# Altium schematic sheet 2轴4.0-.SchDoc
size A3
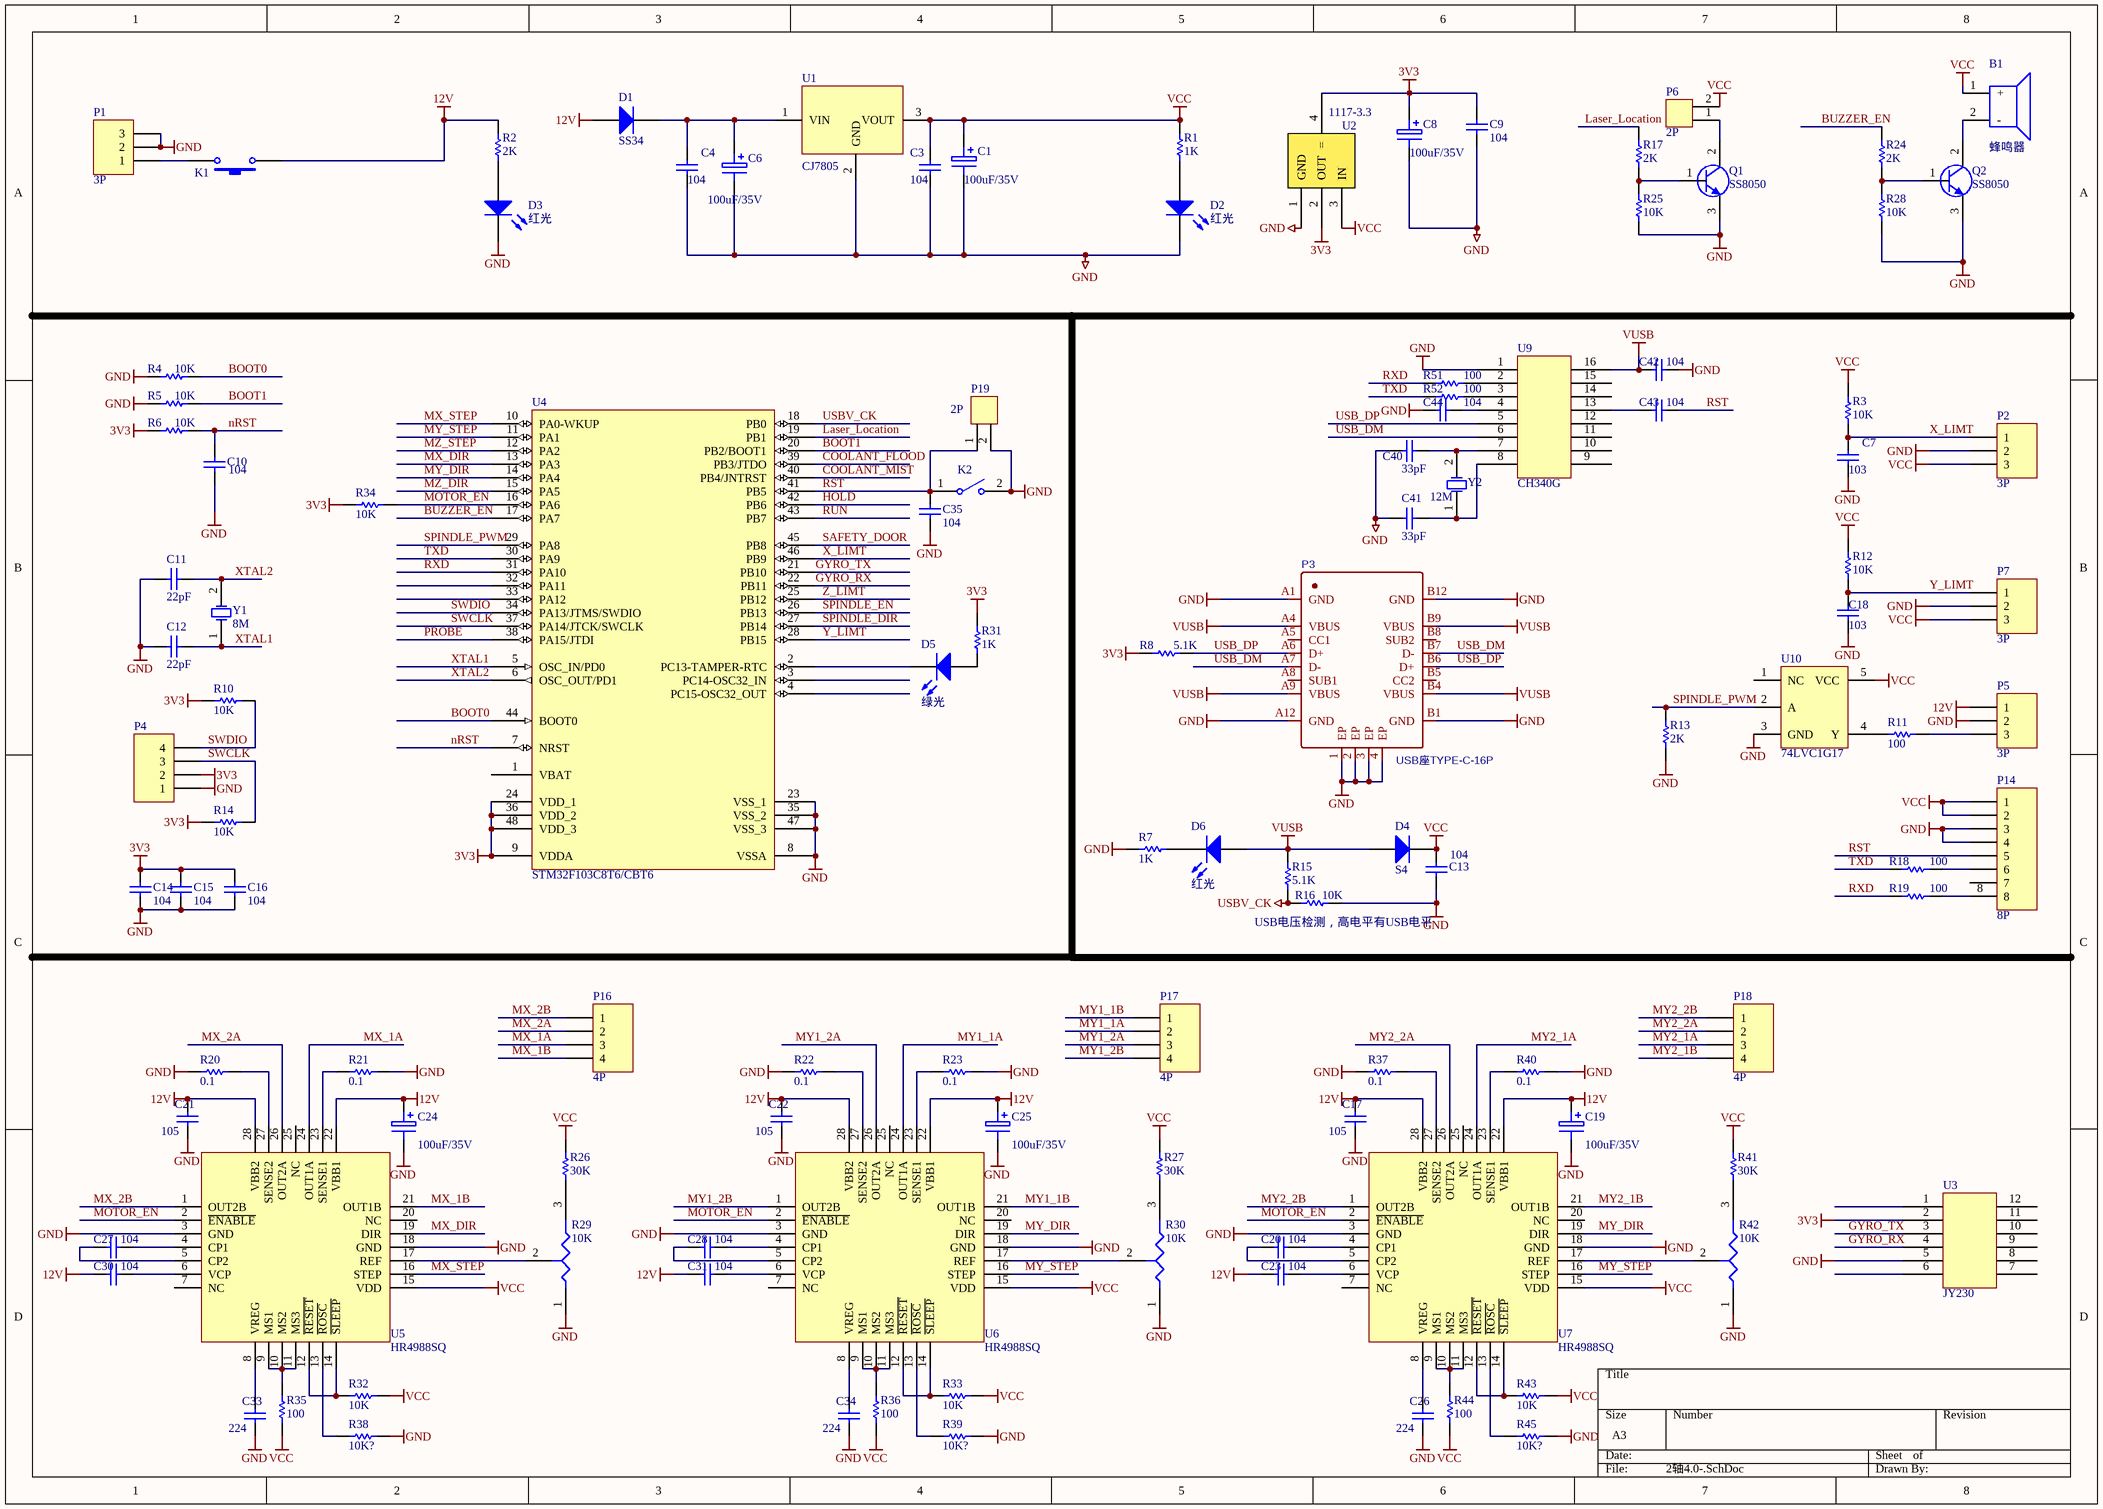
[diagram p0: 2轴4.0-.SchDoc]

## Parts
B1  蜂鸣器  [蜂鸣器9]
C1  100uF/35V  [电解电容贴片6x6]
C3  104  [0603C]
C4  104  [0603C]
C6  100uF/35V  [电解电容贴片6x6]
C7  103  [0603C]
C8  100uF/35V  [电解电容贴片6x6]
C9  104  [0603C]
C10  104  [0603C]
C11  22pF  [0603C]
C12  22pF  [0603C]
C13  104  [0603C]
C14  104  [0603C]
C15  104  [0603C]
C16  104  [0603C]
C17  105  [0805C]
C18  103  [0603C]
C19  100uF/35V  [电解电容贴片6x6]
C20  104  [0603C]
C21  105  [0805C]
C22  105  [0805C]
C23  104  [0603C]
C24  100uF/35V  [电解电容贴片6x6]
C25  100uF/35V  [电解电容贴片6x6]
C26  224  [0603C]
C27  104  [0603C]
C28  104  [0603C]
C30  104  [0603C]
C31  104  [0603C]
C33  224  [0603C]
C34  224  [0603C]
C35  104  [0603C]
C40  33pF  [0603C]
C41  33pF  [0603C]
C42  104  [0603C]
C43  104  [0603C]
C44  104  [0603C]
D1  SS34  [SMA]
D2  红光  [0603LED]
D3  红光  [0603LED]
D4  S4  [SOD-123]
D5  绿光  [0603LED]
D6  红光  [0603LED]
K1  按键  [按键18x13]  (value not drawn)
K2  开关  [按键6x6贴片]  (value not drawn)
P1  3P  [DC0044A]
P2  3P  [HDR1X3_P]
P3  USB座TYPE-C-16P  [USB-TYPE-C-16P]
P4  (no value)  [SIP4]
P5  3P  [HDR1X3_P]
P6  2P  [HDR1X2_P]
P7  3P  [HDR1X3_P]
P14  8P  [IDC8弯脚]
P16  4P  [HDR1X4_P]
P17  4P  [HDR1X4_P]
P18  4P  [HDR1X4_P]
P19  2P  [HDR1X2_P]
Q1  SS8050  [SOT-23]
Q2  SS8050  [SOT-23]
R1  1K  [0603R]
R2  2K  [0603R]
R3  10K  [0603R]
R4  10k  [0603R]
R5  10k  [0603R]
R6  10k  [0603R]
R7  1K  [0603R]
R8  5.1K  [0603R]
R10  10k  [0603R]
R11  100  [0603R]
R12  10K  [0603R]
R13  2K  [0603R]
R14  10k  [0603R]
R15  5.1K  [0603R]
R16  10K  [0603R]
R17  2K  [0603R]
R18  100  [0603R]
R19  100  [0603R]
R20  0.1  [0805R]
R21  0.1  [0805R]
R22  0.1  [0805R]
R23  0.1  [0805R]
R24  2K  [0603R]
R25  10K  [0603R]
R26  30K  [0603R]
R27  30K  [0603R]
R28  10K  [0603R]
R29  10K  [松下贴片电位器3x3]
R30  10K  [松下贴片电位器3x3]
R31  1K  [0603R]
R32  10K  [0603R]
R33  10K  [0603R]
R34  10K  [0603R]
R35  100  [0603R]
R36  100  [0603R]
R37  0.1  [0805R]
R38  10K?  [0603R]
R39  10K?  [0603R]
R40  0.1  [0805R]
R41  30K  [0603R]
R42  10K  [松下贴片电位器3x3]
R43  10K  [0603R]
R44  100  [0603R]
R45  10K?  [0603R]
R51  100  [0603R]
R52  100  [0603R]
U1  CJ7805  [TO-263-2]
U2  1117-3.3  [SOT-223]
U3  JY230  [舵螺仪JY-230]
U4  STM32F103C8T6/CBT6  [LQFP48]
U5  HR4988SQ  [QFN28]
U6  HR4988SQ  [QFN28]
U7  HR4988SQ  [QFN28]
U9  CH340G  [SOP16]
U10  74LVC1G17  [SOT-23-5]
Y1  8M  [晶振贴片]
Y2  12M  [晶振贴片49SSMD]

## Nets
3V3: C8.1 C9.2 C14.2 C15.2 C16.2 P4.2 R6.1 R8.1 R10.2 R14.2 R31.2 R34.2 U2.2(OUT) U2.4(=) U3.2 U4.9(VDDA) U4.24(VDD_1) U4.36(VDD_2) U4.48(VDD_3)
12V: C17.1 C19.1 C21.1 C22.1 C23.2 C24.1 C25.1 C30.2 C31.2 D1.1 K1.1 P5.1 R2.1 U5.22(VBB1) U5.28(VBB2) U6.22(VBB1) U6.28(VBB2) U7.22(VBB1) U7.28(VBB2)
GND: C1.2 C3.1 C4.1 C6.2 C7.1 C8.2 C9.1 C10.1 C11.2 C12.2 C13.1 C14.1 C15.1 C16.1 C17.2 C18.1 C19.2 C21.2 C22.2 C24.2 C25.2 C26.2 C33.2 C34.2 C35.2 C40.2 C41.2 C42.2 C44.2 D2.2 D3.2 K2.2(NO) P1.2 P1.3 P2.2 P3.1(EP) P3.2(EP) P3.3(EP) P3.4(EP) P3.A1(GND) P3.A12(GND) P3.B1(GND) P3.B12(GND) P4.1 P5.2 P7.2 P14.3 P14.4 P19.2 Q1.3(E) Q2.3(E) R4.1 R5.1 R7.1 R13.1 R16.1 R20.2 R21.1 R22.2 R23.1 R25.1 R28.1 R29.1(A) R30.1(A) R37.2 R38.2 R39.2 R40.1 R42.1(A) R45.2 U1.2(GND) U2.1(GND) U3.5 U4.8(VSSA) U4.23(VSS_1) U4.35(VSS_2) U4.47(VSS_3) U5.3(GND) U5.18(GND) U6.3(GND) U6.18(GND) U7.3(GND) U7.18(GND) U9.1 U10.3(GND)
USBV_CK: R15.1 R16.2 U4.18(PB0)
VCC: B1.1(+) C1.1 C3.2 C13.2 D4.2 P2.3 P6.2 P7.3 P14.1 P14.2 R1.1 R3.2 R12.2 R26.2 R27.2 R32.1 R33.1 R35.1 R36.1 R41.2 R43.1 R44.1 U1.3(VOUT) U2.3(IN) U5.15(VDD) U6.15(VDD) U7.15(VDD) U10.5(VCC)
VUSB: C42.1 D4.1 D6.1 P3.A4(VBUS) P3.A9(VBUS) P3.B4(VBUS) P3.B9(VBUS) R15.2 U9.16
BOOT0: R4.2 U4.44(BOOT0)
BOOT1: R5.2 U4.20(PB2/BOOT1)
BUZZER_EN: R24.1 U4.17(PA7)
COOLANT_FLOOD: U4.39(PB3/JTDO)
COOLANT_MIST: U4.40(PB4/JNTRST)
GYRO_RX: U3.4 U4.22(PB11)
GYRO_TX: U3.3 U4.21(PB10)
HOLD: U4.42(PB6)
Laser_Location: R17.1 U4.19(PB1)
MOTOR_EN: R34.1 U4.16(PA6) U5.2(~{ENABLE}) U6.2(~{ENABLE}) U7.2(~{ENABLE})
MX_1A: P16.3 U5.24(OUT1A)
MX_1B: P16.4 U5.21(OUT1B)
MX_2A: P16.2 U5.26(OUT2A)
MX_2B: P16.1 U5.1(OUT2B)
MX_DIR: U4.13(PA3) U5.19(DIR)
MX_STEP: U4.10(PA0-WKUP) U5.16(STEP)
MY1_1A: P17.2 U6.24(OUT1A)
MY1_1B: P17.1 U6.21(OUT1B)
MY1_2A: P17.3 U6.26(OUT2A)
MY1_2B: P17.4 U6.1(OUT2B)
MY2_1A: P18.3 U7.24(OUT1A)
MY2_1B: P18.4 U7.21(OUT1B)
MY2_2A: P18.2 U7.26(OUT2A)
MY2_2B: P18.1 U7.1(OUT2B)
MY_DIR: U4.14(PA4) U6.19(DIR) U7.19(DIR)
MY_STEP: U4.11(PA1) U6.16(STEP) U7.16(STEP)
MZ_DIR: U4.15(PA5)
MZ_STEP: U4.12(PA2)
nRST: C10.2 R6.2 U4.7(NRST)
PROBE: U4.38(PA15/JTDI)
RST: C35.1 C43.2 K2.1(COMMON) P14.5 P19.1 U4.41(PB5)
RUN: U4.43(PB7)
RXD: R19.1 R51.2 U4.31(PA10)
SAFETY_DOOR: U4.45(PB8)
SPINDLE_DIR: U4.27(PB14)
SPINDLE_EN: U4.26(PB13)
SPINDLE_PWM: R13.2 U4.29(PA8) U10.2(A)
SWCLK: P4.3 R14.1 U4.37(PA14/JTCK/SWCLK)
SWDIO: P4.4 R10.1 U4.34(PA13/JTMS/SWDIO)
TXD: R18.1 R52.2 U4.30(PA9)
USB_DM: P3.A7(D-) P3.B7(D-) U9.6
USB_DP: P3.A6(D+) P3.B6(D+) R8.2 U9.5
X_LIMT: C7.2 P2.1 R3.1 U4.46(PB9)
XTAL1: C12.1 U4.5(OSC_IN/PD0) Y1.1(OSC1)
XTAL2: C11.1 U4.6(OSC_OUT/PD1) Y1.2(OSC2)
Y_LIMT: C18.2 P7.1 R12.1 U4.28(PB15)
Z_LIMT: U4.25(PB12)
NetB1_2: B1.2(-) Q2.2(C)
NetC4_2: C4.2 C6.1 D1.2 U1.1(VIN)
NetC20_1: C20.1 U7.4(CP1)
NetC20_2: C20.2 U7.5(CP2)
NetC23_1: C23.1 U7.6(VCP)
NetC26_1: C26.1 U7.8(VREG)
NetC27_1: C27.1 U5.4(CP1)
NetC27_2: C27.2 U5.5(CP2)
NetC28_1: C28.1 U6.4(CP1)
NetC28_2: C28.2 U6.5(CP2)
NetC30_1: C30.1 U5.6(VCP)
NetC31_1: C31.1 U6.6(VCP)
NetC33_1: C33.1 U5.8(VREG)
NetC34_1: C34.1 U6.8(VREG)
NetC40_1: C40.1 U9.7 Y2.2(OSC2)
NetC41_1: C41.1 U9.8 Y2.1(OSC1)
NetC43_1: C43.1 U9.13
NetC44_1: C44.1 U9.4
NetD2_1: D2.1 R1.2
NetD3_1: D3.1 R2.2
NetD5_1: D5.1 R31.1
NetD5_2: D5.2 U4.2(PC13-TAMPER-RTC)
NetD6_2: D6.2 R7.2
NetK1_2: K1.2 P1.1
NetP5_3: P5.3 R11.2
NetP6_1: P6.1 Q1.2(C)
NetP14_6: P14.6 R18.2
NetP14_8: P14.8 R19.2
NetQ1_1: Q1.1(B) R17.2 R25.2
NetQ2_1: Q2.1(B) R24.2 R28.2
NetR11_1: R11.1 U10.4(Y)
NetR20_1: R20.1 U5.27(SENSE2)
NetR21_2: R21.2 U5.23(SENSE1)
NetR22_1: R22.1 U6.27(SENSE2)
NetR23_2: R23.2 U6.23(SENSE1)
NetR26_1: R26.1 R29.3(B)
NetR27_1: R27.1 R30.3(B)
NetR29_2: R29.2(TAP) U5.17(REF)
NetR30_2: R30.2(TAP) U6.17(REF)
NetR32_2: R32.2 U5.12(~{RESET}) U5.14(~{SLEEP})
NetR33_2: R33.2 U6.12(~{RESET}) U6.14(~{SLEEP})
NetR35_2: R35.2 U5.9(MS1) U5.10(MS2) U5.11(MS3)
NetR36_2: R36.2 U6.9(MS1) U6.10(MS2) U6.11(MS3)
NetR37_1: R37.1 U7.27(SENSE2)
NetR38_1: R38.1 U5.13(~{ROSC})
NetR39_1: R39.1 U6.13(~{ROSC})
NetR40_2: R40.2 U7.23(SENSE1)
NetR41_1: R41.1 R42.3(B)
NetR42_2: R42.2(TAP) U7.17(REF)
NetR43_2: R43.2 U7.12(~{RESET}) U7.14(~{SLEEP})
NetR44_2: R44.2 U7.9(MS1) U7.10(MS2) U7.11(MS3)
NetR45_1: R45.1 U7.13(~{ROSC})
NetR51_1: R51.1 U9.2
NetR52_1: R52.1 U9.3

Not connected (* = marked no-connect by the designer): P3 A5(CC1) A8(SUB1) B5(CC2) B8(SUB2); P14 7; U3 1 6 7 8 9 10 11 12; U4 1(VBAT) 3(PC14-OSC32_IN) 4(PC15-OSC32_OUT) 32(PA11) 33(PA12); U5 7(NC) 20(NC) 25(NC); U6 7(NC) 20(NC) 25(NC); U7 7(NC) 20(NC) 25(NC); U9 9 10 11 12 14 15; U10 1(NC)

## Notes on the sheet
- (near R16) USB电压检测，高电平有USB电平

## Library data of the parts
C1 C6 C8 C19 C24 C25 = ELECTRO1
C3 C9 C10 C13 C35 C42-C44 = Cap Semi: Capacitor (Semiconductor SIM Model); Published: 8-Jun-2000; LatestRevisionDate: 17-Jul-2002; LatestRevisionNote: Re-released for DXP Platform.; PackageReference: C1206; Publisher: Altium Limited
  C3 C9 C42 C43: Value: 104
C4 C7 C14-C18 C20-C23 C26-C28 C30 C31 C33 C34 = CAP
  C14-C16: value: 104
C11 C12 = Cap Semi: Capacitor (Semiconductor SIM Model); Value: 100pF; Published: 8-Jun-2000; LatestRevisionDate: 17-Jul-2002; LatestRevisionNote: Re-released for DXP Platform.; PackageReference: C1206; Publisher: Altium Limited
C40 C41 = Cap Semi: Capacitor (Semiconductor SIM Model); Value: 18pF; Published: 8-Jun-2000; LatestRevisionDate: 17-Jul-2002; LatestRevisionNote: Re-released for DXP Platform.; PackageReference: C1206; Publisher: Altium Limited
D1 D4 = 1N4148
D2 D3 D5 D6 = LED
P3 = USB座TYPE-C-16P: BOM_Manufacturer: Shenzhen Kinghelm Elec; BOM_Manufacturer Part: KH-TYPE-C-16P-T; Contributor: LCSC; BOM_Supplier: LCSC; BOM_Supplier Part: C709358; spicePre: U; spiceSymbolName: KH-TYPE-C-16P-T
P4 = 4P
Q1 Q2 = NPN: Published: 8-Jun-2000; LatestRevisionDate: 17-Jul-2002; LatestRevisionNote: Re-released for DXP Platform.; PackageReference: TO-226; Publisher: Altium Limited; Code_JEDEC: TO-226-AA
R1-R8 R10-R28 R31-R41 R43-R45 R51 R52 = RES: Resistor; Published: 8-Jun-2000; LatestRevisionDate: 17-Jul-2002; LatestRevisionNote: Re-released for DXP Platform.; PackageReference: AXIAL-0.3; Publisher: Altium Limited
  R4-R6 R10 R14: Value: 10K
R29 R30 R42 = 电位器
U1 = 7805
U2 = LM1117
U3 = DIP12
U4 = STM32F103C6T6: STM32 ARM-based 32-bit MCU with 32 Kbytes Flash, 48-pin LQFP, Industrial Temperature; Published: *; DatasheetVersion: *; PackageVersion: *; PackageReference: *; Publisher: *; PackageDescription: *; ComponentLink1Description: *; ComponentLink1URL: *; ComponentLink2Description: *; ComponentLink2URL: *
U5-U7 = HR4988
U9 = DIP16
Y1 Y2 = XTAL: Crystal Oscillator; Published: 8-Jun-2000; LatestRevisionDate: 17-Jul-2002; LatestRevisionNote: Re-released for DXP Platform.; PackageReference: R38; Publisher: Altium Limited